# Altium schematic sheet TopLevel.SchDoc: =project_title
size Tabloid; CompanyName: Luxonis Holding; Organization: Luxonis Holding; Address1: 1925 Harmony Park Drive; Address2: Westminster, CO; Address3: 80234; Address4: United States; SheetNumber: 2; SheetTotal: 6
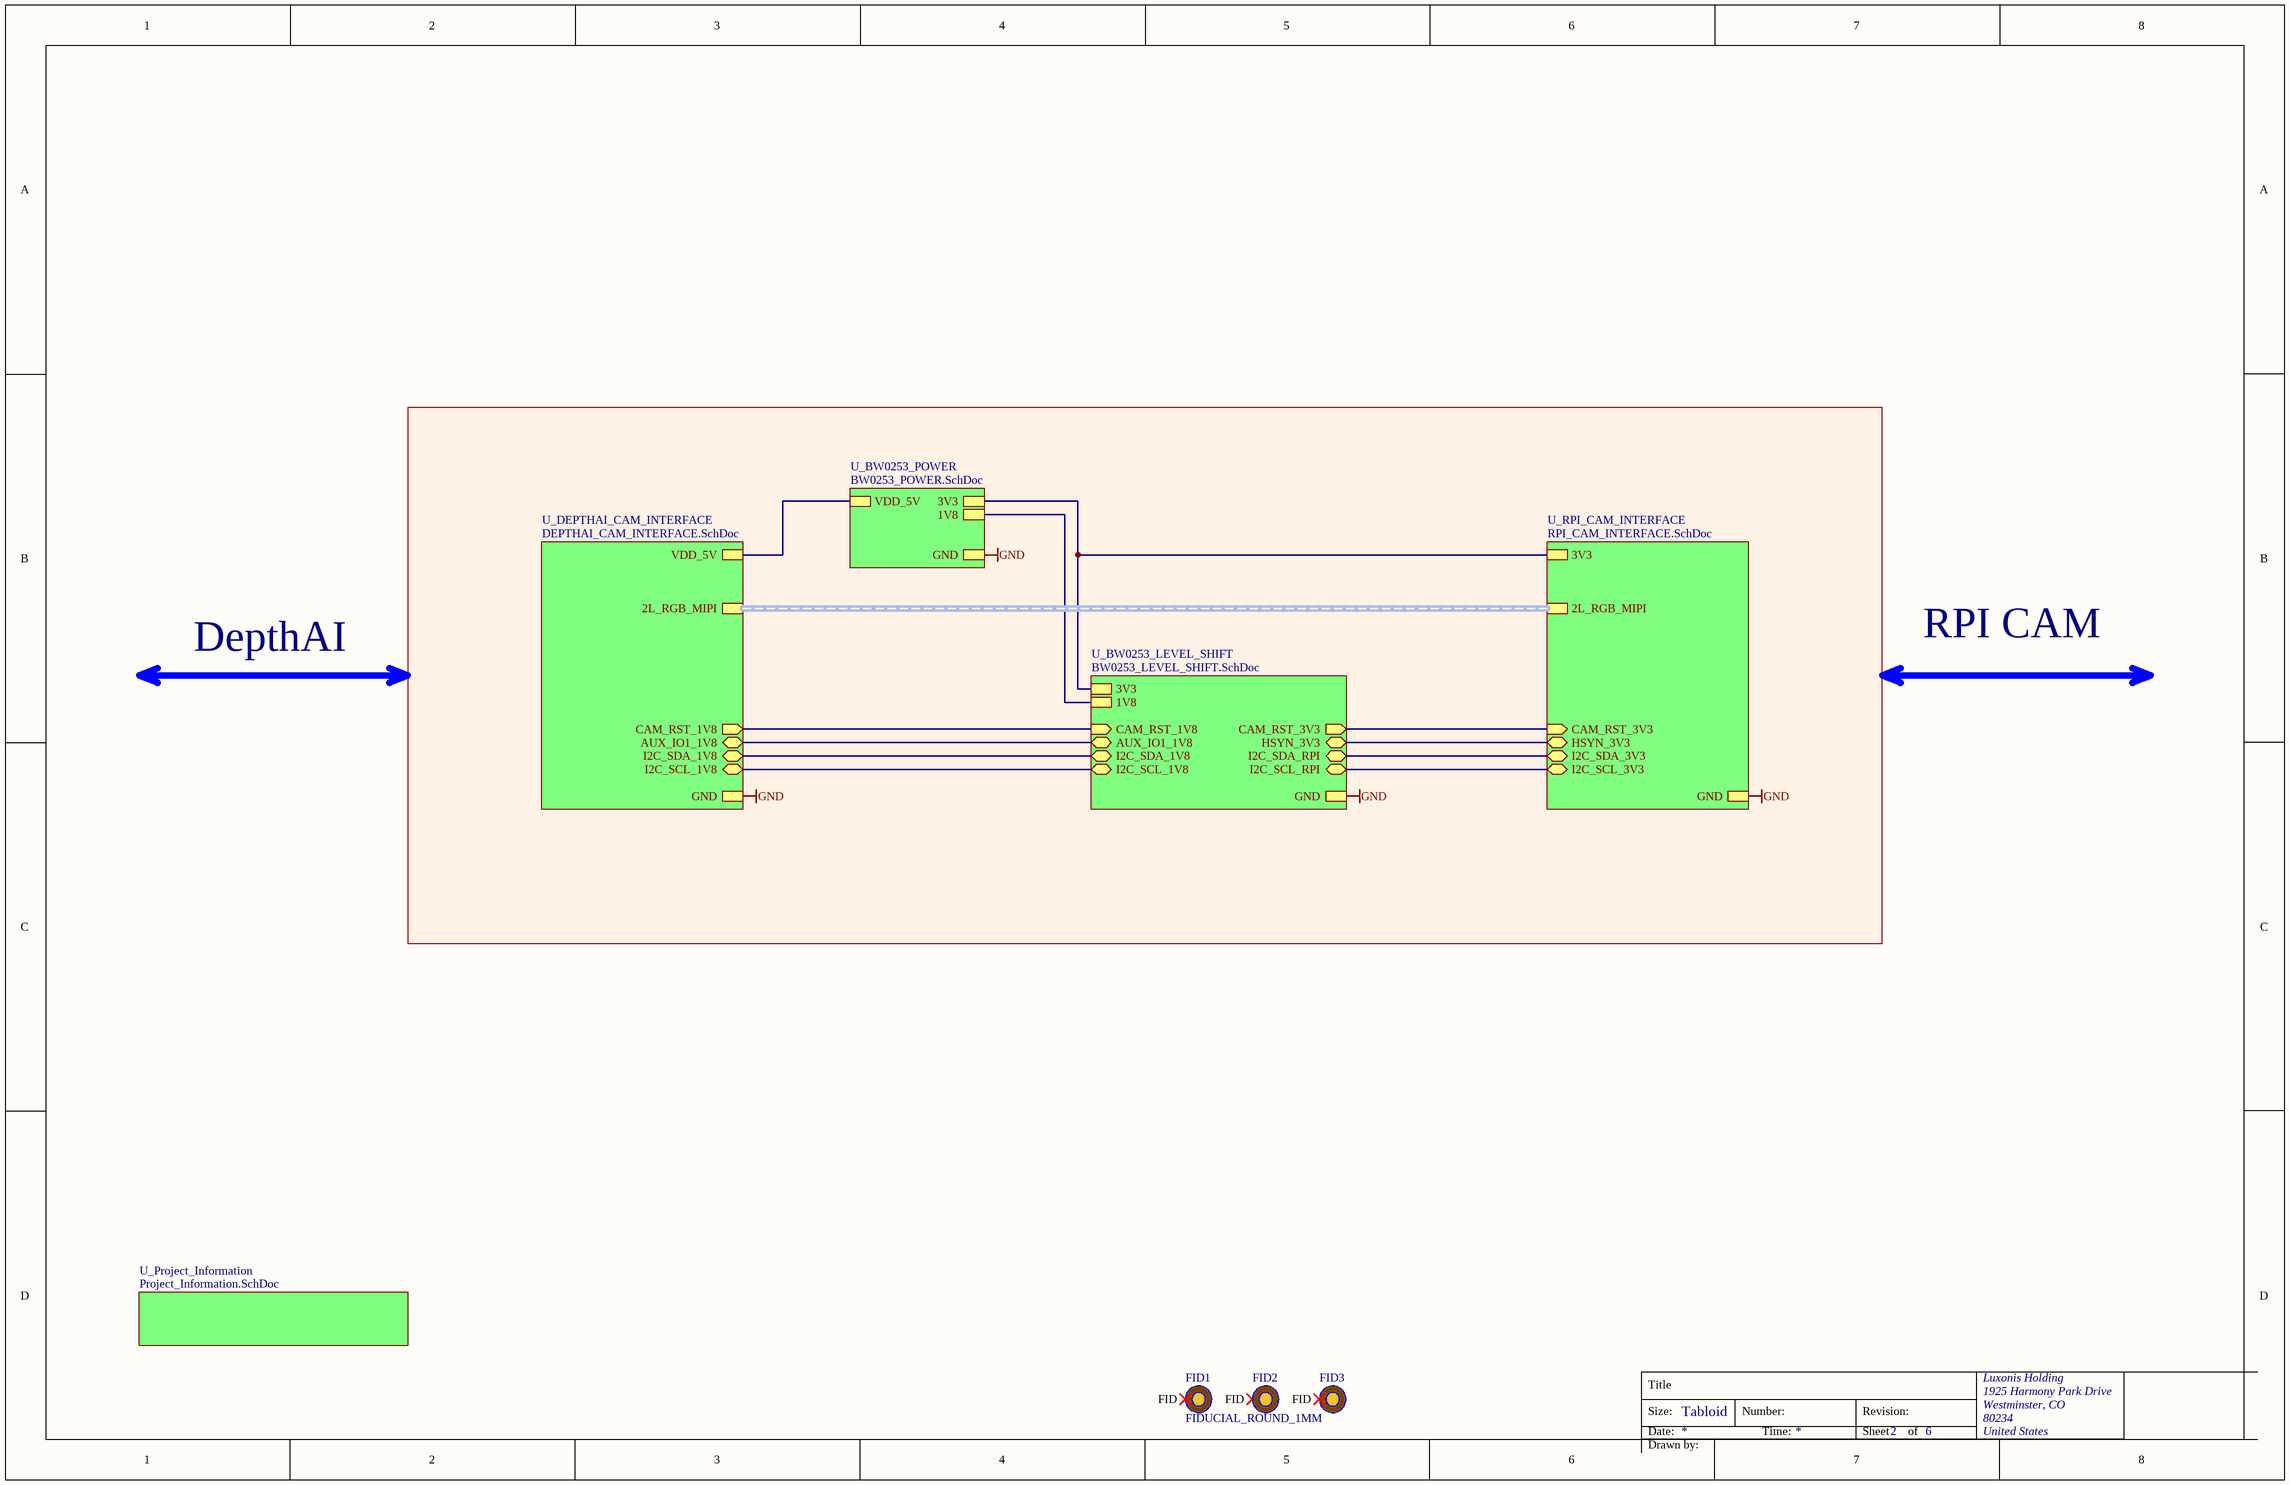
[diagram p0: TopLevel.SchDoc]

## Parts
FID1  FIDUCIAL_ROUND_1MM  [FIDUCIAL_ROUND_1MM]  (no BOM)
FID2  FIDUCIAL_ROUND_1MM  [FIDUCIAL_ROUND_1MM]  (value not drawn)  (no BOM)
FID3  FIDUCIAL_ROUND_1MM  [FIDUCIAL_ROUND_1MM]  (value not drawn)  (no BOM)

## Sub-sheets
U_BW0253_LEVEL_SHIFT = BW0253_LEVEL_SHIFT.SchDoc: GND, 1V8, 3V3, I2C_SCL_RPI (bidir), I2C_SDA_1V8 (bidir), HSYN_3V3 (bidir), I2C_SDA_RPI (bidir), AUX_IO1_1V8 (bidir), CAM_RST_3V3 (out), I2C_SCL_1V8 (bidir), CAM_RST_1V8 (in)
U_BW0253_POWER = BW0253_POWER.SchDoc: 1V8, 3V3, VDD_5V, GND
U_DEPTHAI_CAM_INTERFACE = DEPTHAI_CAM_INTERFACE.SchDoc: 2L_RGB_MIPI (harness 2L_RGB_MIPI), VDD_5V, GND, AUX_IO1_1V8 (bidir), I2C_SDA_1V8 (bidir), CAM_RST_1V8 (out), I2C_SCL_1V8 (bidir)
U_Project_Information = Project_Information.SchDoc: no entries
U_RPI_CAM_INTERFACE = RPI_CAM_INTERFACE.SchDoc: 2L_RGB_MIPI (harness 2L_RGB_MIPI), GND, 3V3, CAM_RST_3V3 (in), HSYN_3V3 (bidir), I2C_SCL_3V3 (bidir), I2C_SDA_3V3 (bidir)

## Nets
GND: sheet U_BW0253_POWER/GND, sheet U_BW0253_LEVEL_SHIFT/GND, sheet U_DEPTHAI_CAM_INTERFACE/GND, sheet U_RPI_CAM_INTERFACE/GND
(unnamed): sheet U_BW0253_POWER/1V8, sheet U_BW0253_LEVEL_SHIFT/1V8
(unnamed): sheet U_BW0253_POWER/3V3, sheet U_BW0253_LEVEL_SHIFT/3V3, sheet U_RPI_CAM_INTERFACE/3V3
(unnamed): sheet U_BW0253_POWER/VDD_5V, sheet U_DEPTHAI_CAM_INTERFACE/VDD_5V
(unnamed): sheet U_BW0253_LEVEL_SHIFT/I2C_SCL_RPI, sheet U_RPI_CAM_INTERFACE/I2C_SCL_3V3
(unnamed): sheet U_BW0253_LEVEL_SHIFT/I2C_SDA_1V8, sheet U_DEPTHAI_CAM_INTERFACE/I2C_SDA_1V8
(unnamed): sheet U_BW0253_LEVEL_SHIFT/HSYN_3V3, sheet U_RPI_CAM_INTERFACE/HSYN_3V3
(unnamed): sheet U_BW0253_LEVEL_SHIFT/I2C_SDA_RPI, sheet U_RPI_CAM_INTERFACE/I2C_SDA_3V3
(unnamed): sheet U_BW0253_LEVEL_SHIFT/AUX_IO1_1V8, sheet U_DEPTHAI_CAM_INTERFACE/AUX_IO1_1V8
(unnamed): sheet U_BW0253_LEVEL_SHIFT/CAM_RST_3V3, sheet U_RPI_CAM_INTERFACE/CAM_RST_3V3
(unnamed): sheet U_BW0253_LEVEL_SHIFT/I2C_SCL_1V8, sheet U_DEPTHAI_CAM_INTERFACE/I2C_SCL_1V8
(unnamed): sheet U_BW0253_LEVEL_SHIFT/CAM_RST_1V8, sheet U_DEPTHAI_CAM_INTERFACE/CAM_RST_1V8

Not connected (* = marked no-connect by the designer): FID1 FID*; FID2 FID*; FID3 FID*

## Buses and harness runs
harness sheet U_DEPTHAI_CAM_INTERFACE/2L_RGB_MIPI = sheet U_RPI_CAM_INTERFACE/2L_RGB_MIPI

## Notes on the sheet
- DepthAI
- RPI CAM
- Title
- Size:
- Date:
- Tabloid
- Number:
- Time:
- Revision:
- Sheet
- of
- Drawn by:

## Library data of the parts
FID1-FID3 = FIDUCIAL: Fiducial with various available footprints